# Altium project LED fix910 RD 2000278 (4F00224A_7P00494A).PrjPcb
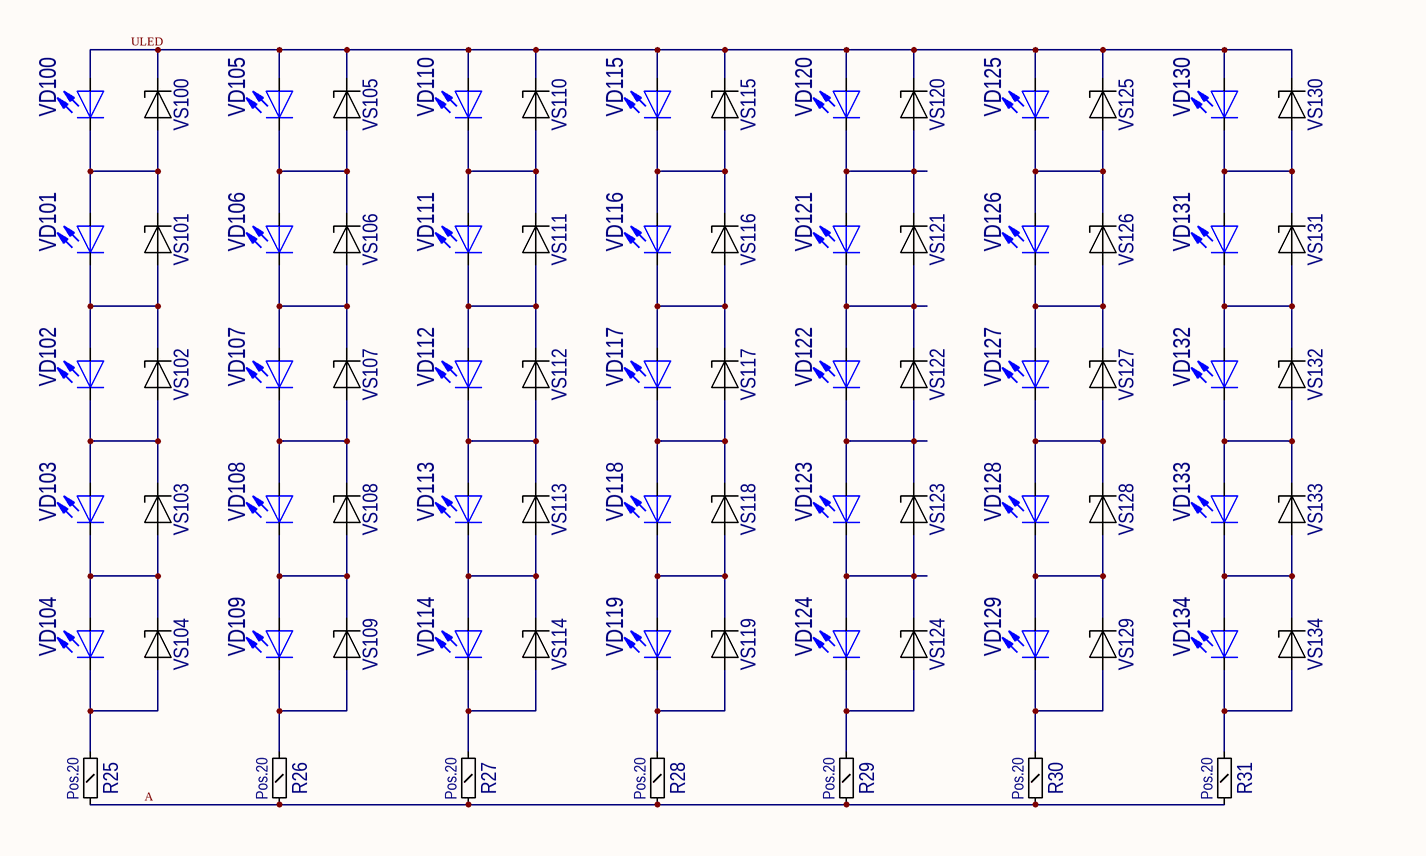
[diagram p0: LED fix910 RD 2000278 (4F00224A_7P00494A)_2.SchDoc, left]
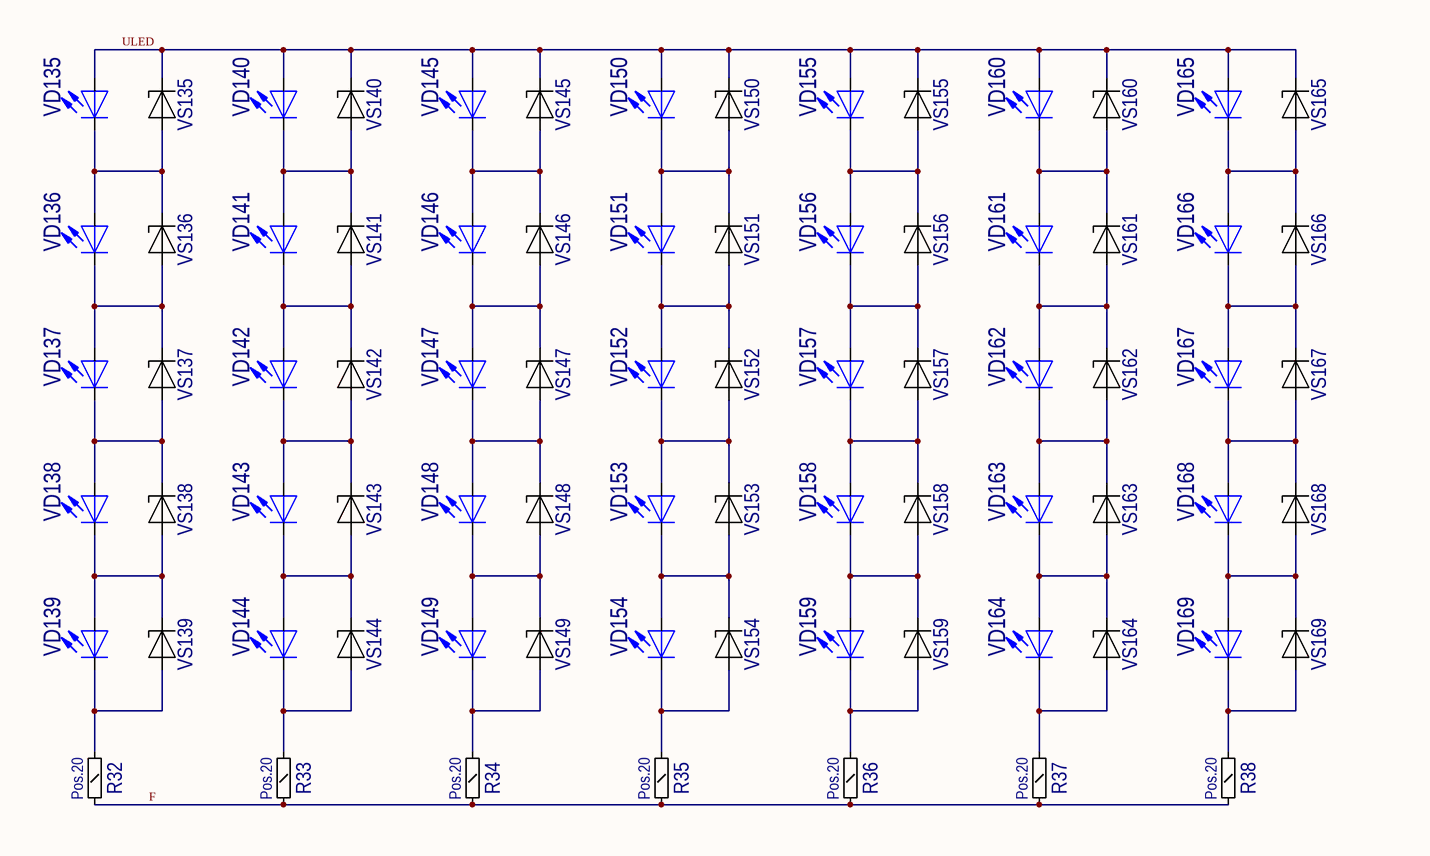
[diagram p1: LED fix910 RD 2000278 (4F00224A_7P00494A)_2.SchDoc, middle]
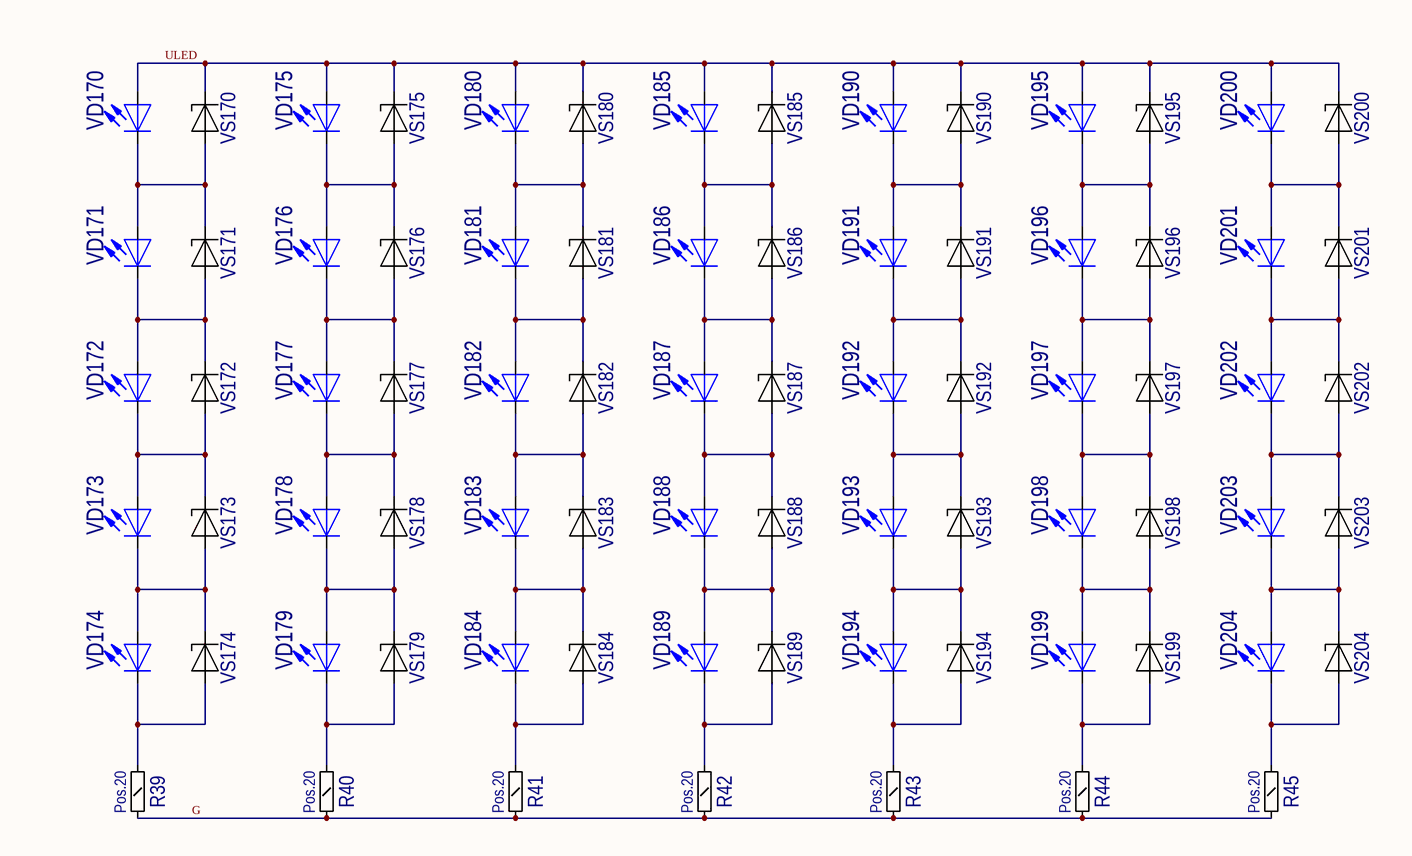
[diagram p2: LED fix910 RD 2000278 (4F00224A_7P00494A)_2.SchDoc, right]
2 sheets, 454 parts. Net scope: global (net labels, ports and power ports of the same name join across sheets).
Board file: LED fix910 RD 2000278 (4F00224A_7P00494A).PcbDoc
Sheets:
  LED fix910 RD 2000278 (4F00224A_7P00494A)_2.SchDoc
  LED fix910 RD 2000278 (4F00224A_7P00494A)_1.SchDoc

## Sheet LED fix910 RD 2000278 (4F00224A_7P00494A)_2.SchDoc
size 849 x 241 mm

### Parts
R25  value Pos.20  [RC1206S]  (hidden comment: R1206S)
R26  value Pos.20  [RC1206S]  (hidden comment: R1206S)
R27  value Pos.20  [RC1206S]  (hidden comment: R1206S)
R28  value Pos.20  [RC1206S]  (hidden comment: R1206S)
R29  value Pos.20  [RC1206S]  (hidden comment: R1206S)
R30  value Pos.20  [RC1206S]  (hidden comment: R1206S)
R31  value Pos.20  [RC1206S]  (hidden comment: R1206S)
R32  value Pos.20  [RC1206S]  (hidden comment: R1206S)
R33  value Pos.20  [RC1206S]  (hidden comment: R1206S)
R34  value Pos.20  [RC1206S]  (hidden comment: R1206S)
R35  value Pos.20  [RC1206S]  (hidden comment: R1206S)
R36  value Pos.20  [RC1206S]  (hidden comment: R1206S)
R37  value Pos.20  [RC1206S]  (hidden comment: R1206S)
R38  value Pos.20  [RC1206S]  (hidden comment: R1206S)
R39  value Pos.20  [RC1206S]  (hidden comment: R1206S)
R40  value Pos.20  [RC1206S]  (hidden comment: R1206S)
R41  value Pos.20  [RC1206S]  (hidden comment: R1206S)
R42  value Pos.20  [RC1206S]  (hidden comment: R1206S)
R43  value Pos.20  [RC1206S]  (hidden comment: R1206S)
R44  value Pos.20  [RC1206S]  (hidden comment: R1206S)
R45  value Pos.20  [RC1206S]  (hidden comment: R1206S)
VD100  LED, LS E65F-BBDA-1-Z, Red, OSRAM Opto Semiconductors Inc.  [E65F]  (value not drawn)
VD101  LED, LS E65F-BBDA-1-Z, Red, OSRAM Opto Semiconductors Inc.  [E65F]  (value not drawn)
VD102  LED, LS E65F-BBDA-1-Z, Red, OSRAM Opto Semiconductors Inc.  [E65F]  (value not drawn)
VD103  LED, LS E65F-BBDA-1-Z, Red, OSRAM Opto Semiconductors Inc.  [E65F]  (value not drawn)
VD104  LED, LS E65F-BBDA-1-Z, Red, OSRAM Opto Semiconductors Inc.  [E65F]  (value not drawn)
VD105  LED, LS E65F-BBDA-1-Z, Red, OSRAM Opto Semiconductors Inc.  [E65F]  (value not drawn)
VD106  LED, LS E65F-BBDA-1-Z, Red, OSRAM Opto Semiconductors Inc.  [E65F]  (value not drawn)
VD107  LED, LS E65F-BBDA-1-Z, Red, OSRAM Opto Semiconductors Inc.  [E65F]  (value not drawn)
VD108  LED, LS E65F-BBDA-1-Z, Red, OSRAM Opto Semiconductors Inc.  [E65F]  (value not drawn)
VD109  LED, LS E65F-BBDA-1-Z, Red, OSRAM Opto Semiconductors Inc.  [E65F]  (value not drawn)
VD110  LED, LS E65F-BBDA-1-Z, Red, OSRAM Opto Semiconductors Inc.  [E65F]  (value not drawn)
VD111  LED, LS E65F-BBDA-1-Z, Red, OSRAM Opto Semiconductors Inc.  [E65F]  (value not drawn)
VD112  LED, LS E65F-BBDA-1-Z, Red, OSRAM Opto Semiconductors Inc.  [E65F]  (value not drawn)
VD113  LED, LS E65F-BBDA-1-Z, Red, OSRAM Opto Semiconductors Inc.  [E65F]  (value not drawn)
VD114  LED, LS E65F-BBDA-1-Z, Red, OSRAM Opto Semiconductors Inc.  [E65F]  (value not drawn)
VD115  LED, LS E65F-BBDA-1-Z, Red, OSRAM Opto Semiconductors Inc.  [E65F]  (value not drawn)
VD116  LED, LS E65F-BBDA-1-Z, Red, OSRAM Opto Semiconductors Inc.  [E65F]  (value not drawn)
VD117  LED, LS E65F-BBDA-1-Z, Red, OSRAM Opto Semiconductors Inc.  [E65F]  (value not drawn)
VD118  LED, LS E65F-BBDA-1-Z, Red, OSRAM Opto Semiconductors Inc.  [E65F]  (value not drawn)
VD119  LED, LS E65F-BBDA-1-Z, Red, OSRAM Opto Semiconductors Inc.  [E65F]  (value not drawn)
VD120  LED, LS E65F-BBDA-1-Z, Red, OSRAM Opto Semiconductors Inc.  [E65F]  (value not drawn)
VD121  LED, LS E65F-BBDA-1-Z, Red, OSRAM Opto Semiconductors Inc.  [E65F]  (value not drawn)
VD122  LED, LS E65F-BBDA-1-Z, Red, OSRAM Opto Semiconductors Inc.  [E65F]  (value not drawn)
VD123  LED, LS E65F-BBDA-1-Z, Red, OSRAM Opto Semiconductors Inc.  [E65F]  (value not drawn)
VD124  LED, LS E65F-BBDA-1-Z, Red, OSRAM Opto Semiconductors Inc.  [E65F]  (value not drawn)
VD125  LED, LS E65F-BBDA-1-Z, Red, OSRAM Opto Semiconductors Inc.  [E65F]  (value not drawn)
VD126  LED, LS E65F-BBDA-1-Z, Red, OSRAM Opto Semiconductors Inc.  [E65F]  (value not drawn)
VD127  LED, LS E65F-BBDA-1-Z, Red, OSRAM Opto Semiconductors Inc.  [E65F]  (value not drawn)
VD128  LED, LS E65F-BBDA-1-Z, Red, OSRAM Opto Semiconductors Inc.  [E65F]  (value not drawn)
VD129  LED, LS E65F-BBDA-1-Z, Red, OSRAM Opto Semiconductors Inc.  [E65F]  (value not drawn)
VD130  LED, LS E65F-BBDA-1-Z, Red, OSRAM Opto Semiconductors Inc.  [E65F]  (value not drawn)
VD131  LED, LS E65F-BBDA-1-Z, Red, OSRAM Opto Semiconductors Inc.  [E65F]  (value not drawn)
VD132  LED, LS E65F-BBDA-1-Z, Red, OSRAM Opto Semiconductors Inc.  [E65F]  (value not drawn)
VD133  LED, LS E65F-BBDA-1-Z, Red, OSRAM Opto Semiconductors Inc.  [E65F]  (value not drawn)
VD134  LED, LS E65F-BBDA-1-Z, Red, OSRAM Opto Semiconductors Inc.  [E65F]  (value not drawn)
VD135  LED, LS E65F-BBDA-1-Z, Red, OSRAM Opto Semiconductors Inc.  [E65F]  (value not drawn)
VD136  LED, LS E65F-BBDA-1-Z, Red, OSRAM Opto Semiconductors Inc.  [E65F]  (value not drawn)
VD137  LED, LS E65F-BBDA-1-Z, Red, OSRAM Opto Semiconductors Inc.  [E65F]  (value not drawn)
VD138  LED, LS E65F-BBDA-1-Z, Red, OSRAM Opto Semiconductors Inc.  [E65F]  (value not drawn)
VD139  LED, LS E65F-BBDA-1-Z, Red, OSRAM Opto Semiconductors Inc.  [E65F]  (value not drawn)
VD140  LED, LS E65F-BBDA-1-Z, Red, OSRAM Opto Semiconductors Inc.  [E65F]  (value not drawn)
VD141  LED, LS E65F-BBDA-1-Z, Red, OSRAM Opto Semiconductors Inc.  [E65F]  (value not drawn)
VD142  LED, LS E65F-BBDA-1-Z, Red, OSRAM Opto Semiconductors Inc.  [E65F]  (value not drawn)
VD143  LED, LS E65F-BBDA-1-Z, Red, OSRAM Opto Semiconductors Inc.  [E65F]  (value not drawn)
VD144  LED, LS E65F-BBDA-1-Z, Red, OSRAM Opto Semiconductors Inc.  [E65F]  (value not drawn)
VD145  LED, LS E65F-BBDA-1-Z, Red, OSRAM Opto Semiconductors Inc.  [E65F]  (value not drawn)
VD146  LED, LS E65F-BBDA-1-Z, Red, OSRAM Opto Semiconductors Inc.  [E65F]  (value not drawn)
VD147  LED, LS E65F-BBDA-1-Z, Red, OSRAM Opto Semiconductors Inc.  [E65F]  (value not drawn)
VD148  LED, LS E65F-BBDA-1-Z, Red, OSRAM Opto Semiconductors Inc.  [E65F]  (value not drawn)
VD149  LED, LS E65F-BBDA-1-Z, Red, OSRAM Opto Semiconductors Inc.  [E65F]  (value not drawn)
VD150  LED, LS E65F-BBDA-1-Z, Red, OSRAM Opto Semiconductors Inc.  [E65F]  (value not drawn)
VD151  LED, LS E65F-BBDA-1-Z, Red, OSRAM Opto Semiconductors Inc.  [E65F]  (value not drawn)
VD152  LED, LS E65F-BBDA-1-Z, Red, OSRAM Opto Semiconductors Inc.  [E65F]  (value not drawn)
VD153  LED, LS E65F-BBDA-1-Z, Red, OSRAM Opto Semiconductors Inc.  [E65F]  (value not drawn)
VD154  LED, LS E65F-BBDA-1-Z, Red, OSRAM Opto Semiconductors Inc.  [E65F]  (value not drawn)
VD155  LED, LS E65F-BBDA-1-Z, Red, OSRAM Opto Semiconductors Inc.  [E65F]  (value not drawn)
VD156  LED, LS E65F-BBDA-1-Z, Red, OSRAM Opto Semiconductors Inc.  [E65F]  (value not drawn)
VD157  LED, LS E65F-BBDA-1-Z, Red, OSRAM Opto Semiconductors Inc.  [E65F]  (value not drawn)
VD158  LED, LS E65F-BBDA-1-Z, Red, OSRAM Opto Semiconductors Inc.  [E65F]  (value not drawn)
VD159  LED, LS E65F-BBDA-1-Z, Red, OSRAM Opto Semiconductors Inc.  [E65F]  (value not drawn)
VD160  LED, LS E65F-BBDA-1-Z, Red, OSRAM Opto Semiconductors Inc.  [E65F]  (value not drawn)
VD161  LED, LS E65F-BBDA-1-Z, Red, OSRAM Opto Semiconductors Inc.  [E65F]  (value not drawn)
VD162  LED, LS E65F-BBDA-1-Z, Red, OSRAM Opto Semiconductors Inc.  [E65F]  (value not drawn)
VD163  LED, LS E65F-BBDA-1-Z, Red, OSRAM Opto Semiconductors Inc.  [E65F]  (value not drawn)
VD164  LED, LS E65F-BBDA-1-Z, Red, OSRAM Opto Semiconductors Inc.  [E65F]  (value not drawn)
VD165  LED, LS E65F-BBDA-1-Z, Red, OSRAM Opto Semiconductors Inc.  [E65F]  (value not drawn)
VD166  LED, LS E65F-BBDA-1-Z, Red, OSRAM Opto Semiconductors Inc.  [E65F]  (value not drawn)
VD167  LED, LS E65F-BBDA-1-Z, Red, OSRAM Opto Semiconductors Inc.  [E65F]  (value not drawn)
VD168  LED, LS E65F-BBDA-1-Z, Red, OSRAM Opto Semiconductors Inc.  [E65F]  (value not drawn)
VD169  LED, LS E65F-BBDA-1-Z, Red, OSRAM Opto Semiconductors Inc.  [E65F]  (value not drawn)
VD170  LED, LS E65F-BBDA-1-Z, Red, OSRAM Opto Semiconductors Inc.  [E65F]  (value not drawn)
VD171  LED, LS E65F-BBDA-1-Z, Red, OSRAM Opto Semiconductors Inc.  [E65F]  (value not drawn)
VD172  LED, LS E65F-BBDA-1-Z, Red, OSRAM Opto Semiconductors Inc.  [E65F]  (value not drawn)
VD173  LED, LS E65F-BBDA-1-Z, Red, OSRAM Opto Semiconductors Inc.  [E65F]  (value not drawn)
VD174  LED, LS E65F-BBDA-1-Z, Red, OSRAM Opto Semiconductors Inc.  [E65F]  (value not drawn)
VD175  LED, LS E65F-BBDA-1-Z, Red, OSRAM Opto Semiconductors Inc.  [E65F]  (value not drawn)
VD176  LED, LS E65F-BBDA-1-Z, Red, OSRAM Opto Semiconductors Inc.  [E65F]  (value not drawn)
VD177  LED, LS E65F-BBDA-1-Z, Red, OSRAM Opto Semiconductors Inc.  [E65F]  (value not drawn)
VD178  LED, LS E65F-BBDA-1-Z, Red, OSRAM Opto Semiconductors Inc.  [E65F]  (value not drawn)
VD179  LED, LS E65F-BBDA-1-Z, Red, OSRAM Opto Semiconductors Inc.  [E65F]  (value not drawn)
VD180  LED, LS E65F-BBDA-1-Z, Red, OSRAM Opto Semiconductors Inc.  [E65F]  (value not drawn)
VD181  LED, LS E65F-BBDA-1-Z, Red, OSRAM Opto Semiconductors Inc.  [E65F]  (value not drawn)
VD182  LED, LS E65F-BBDA-1-Z, Red, OSRAM Opto Semiconductors Inc.  [E65F]  (value not drawn)
VD183  LED, LS E65F-BBDA-1-Z, Red, OSRAM Opto Semiconductors Inc.  [E65F]  (value not drawn)
VD184  LED, LS E65F-BBDA-1-Z, Red, OSRAM Opto Semiconductors Inc.  [E65F]  (value not drawn)
VD185  LED, LS E65F-BBDA-1-Z, Red, OSRAM Opto Semiconductors Inc.  [E65F]  (value not drawn)
VD186  LED, LS E65F-BBDA-1-Z, Red, OSRAM Opto Semiconductors Inc.  [E65F]  (value not drawn)
VD187  LED, LS E65F-BBDA-1-Z, Red, OSRAM Opto Semiconductors Inc.  [E65F]  (value not drawn)
VD188  LED, LS E65F-BBDA-1-Z, Red, OSRAM Opto Semiconductors Inc.  [E65F]  (value not drawn)
VD189  LED, LS E65F-BBDA-1-Z, Red, OSRAM Opto Semiconductors Inc.  [E65F]  (value not drawn)
VD190  LED, LS E65F-BBDA-1-Z, Red, OSRAM Opto Semiconductors Inc.  [E65F]  (value not drawn)
VD191  LED, LS E65F-BBDA-1-Z, Red, OSRAM Opto Semiconductors Inc.  [E65F]  (value not drawn)
VD192  LED, LS E65F-BBDA-1-Z, Red, OSRAM Opto Semiconductors Inc.  [E65F]  (value not drawn)
VD193  LED, LS E65F-BBDA-1-Z, Red, OSRAM Opto Semiconductors Inc.  [E65F]  (value not drawn)
VD194  LED, LS E65F-BBDA-1-Z, Red, OSRAM Opto Semiconductors Inc.  [E65F]  (value not drawn)
VD195  LED, LS E65F-BBDA-1-Z, Red, OSRAM Opto Semiconductors Inc.  [E65F]  (value not drawn)
VD196  LED, LS E65F-BBDA-1-Z, Red, OSRAM Opto Semiconductors Inc.  [E65F]  (value not drawn)
VD197  LED, LS E65F-BBDA-1-Z, Red, OSRAM Opto Semiconductors Inc.  [E65F]  (value not drawn)
VD198  LED, LS E65F-BBDA-1-Z, Red, OSRAM Opto Semiconductors Inc.  [E65F]  (value not drawn)
VD199  LED, LS E65F-BBDA-1-Z, Red, OSRAM Opto Semiconductors Inc.  [E65F]  (value not drawn)
VD200  LED, LS E65F-BBDA-1-Z, Red, OSRAM Opto Semiconductors Inc.  [E65F]  (value not drawn)
VD201  LED, LS E65F-BBDA-1-Z, Red, OSRAM Opto Semiconductors Inc.  [E65F]  (value not drawn)
VD202  LED, LS E65F-BBDA-1-Z, Red, OSRAM Opto Semiconductors Inc.  [E65F]  (value not drawn)
VD203  LED, LS E65F-BBDA-1-Z, Red, OSRAM Opto Semiconductors Inc.  [E65F]  (value not drawn)
VD204  LED, LS E65F-BBDA-1-Z, Red, OSRAM Opto Semiconductors Inc.  [E65F]  (value not drawn)
VS100  BZX84  [SOT23]  (value not drawn)
VS101  BZX84  [SOT23]  (value not drawn)
VS102  BZX84  [SOT23]  (value not drawn)
VS103  BZX84  [SOT23]  (value not drawn)
VS104  BZX84  [SOT23]  (value not drawn)
VS105  BZX84  [SOT23]  (value not drawn)
VS106  BZX84  [SOT23]  (value not drawn)
VS107  BZX84  [SOT23]  (value not drawn)
VS108  BZX84  [SOT23]  (value not drawn)
VS109  BZX84  [SOT23]  (value not drawn)
VS110  BZX84  [SOT23]  (value not drawn)
VS111  BZX84  [SOT23]  (value not drawn)
VS112  BZX84  [SOT23]  (value not drawn)
VS113  BZX84  [SOT23]  (value not drawn)
VS114  BZX84  [SOT23]  (value not drawn)
VS115  BZX84  [SOT23]  (value not drawn)
VS116  BZX84  [SOT23]  (value not drawn)
VS117  BZX84  [SOT23]  (value not drawn)
VS118  BZX84  [SOT23]  (value not drawn)
VS119  BZX84  [SOT23]  (value not drawn)
VS120  BZX84  [SOT23]  (value not drawn)
VS121  BZX84  [SOT23]  (value not drawn)
VS122  BZX84  [SOT23]  (value not drawn)
VS123  BZX84  [SOT23]  (value not drawn)
VS124  BZX84  [SOT23]  (value not drawn)
VS125  BZX84  [SOT23]  (value not drawn)
VS126  BZX84  [SOT23]  (value not drawn)
VS127  BZX84  [SOT23]  (value not drawn)
VS128  BZX84  [SOT23]  (value not drawn)
VS129  BZX84  [SOT23]  (value not drawn)
VS130  BZX84  [SOT23]  (value not drawn)
VS131  BZX84  [SOT23]  (value not drawn)
VS132  BZX84  [SOT23]  (value not drawn)
VS133  BZX84  [SOT23]  (value not drawn)
VS134  BZX84  [SOT23]  (value not drawn)
VS135  BZX84  [SOT23]  (value not drawn)
VS136  BZX84  [SOT23]  (value not drawn)
VS137  BZX84  [SOT23]  (value not drawn)
VS138  BZX84  [SOT23]  (value not drawn)
VS139  BZX84  [SOT23]  (value not drawn)
VS140  BZX84  [SOT23]  (value not drawn)
VS141  BZX84  [SOT23]  (value not drawn)
VS142  BZX84  [SOT23]  (value not drawn)
VS143  BZX84  [SOT23]  (value not drawn)
VS144  BZX84  [SOT23]  (value not drawn)
VS145  BZX84  [SOT23]  (value not drawn)
VS146  BZX84  [SOT23]  (value not drawn)
VS147  BZX84  [SOT23]  (value not drawn)
VS148  BZX84  [SOT23]  (value not drawn)
VS149  BZX84  [SOT23]  (value not drawn)
VS150  BZX84  [SOT23]  (value not drawn)
VS151  BZX84  [SOT23]  (value not drawn)
VS152  BZX84  [SOT23]  (value not drawn)
VS153  BZX84  [SOT23]  (value not drawn)
VS154  BZX84  [SOT23]  (value not drawn)
VS155  BZX84  [SOT23]  (value not drawn)
VS156  BZX84  [SOT23]  (value not drawn)
VS157  BZX84  [SOT23]  (value not drawn)
VS158  BZX84  [SOT23]  (value not drawn)
VS159  BZX84  [SOT23]  (value not drawn)
VS160  BZX84  [SOT23]  (value not drawn)
VS161  BZX84  [SOT23]  (value not drawn)
VS162  BZX84  [SOT23]  (value not drawn)
VS163  BZX84  [SOT23]  (value not drawn)
VS164  BZX84  [SOT23]  (value not drawn)
VS165  BZX84  [SOT23]  (value not drawn)
VS166  BZX84  [SOT23]  (value not drawn)
VS167  BZX84  [SOT23]  (value not drawn)
VS168  BZX84  [SOT23]  (value not drawn)
VS169  BZX84  [SOT23]  (value not drawn)
VS170  BZX84  [SOT23]  (value not drawn)
VS171  BZX84  [SOT23]  (value not drawn)
VS172  BZX84  [SOT23]  (value not drawn)
VS173  BZX84  [SOT23]  (value not drawn)
VS174  BZX84  [SOT23]  (value not drawn)
VS175  BZX84  [SOT23]  (value not drawn)
VS176  BZX84  [SOT23]  (value not drawn)
VS177  BZX84  [SOT23]  (value not drawn)
VS178  BZX84  [SOT23]  (value not drawn)
VS179  BZX84  [SOT23]  (value not drawn)
VS180  BZX84  [SOT23]  (value not drawn)
VS181  BZX84  [SOT23]  (value not drawn)
VS182  BZX84  [SOT23]  (value not drawn)
VS183  BZX84  [SOT23]  (value not drawn)
VS184  BZX84  [SOT23]  (value not drawn)
VS185  BZX84  [SOT23]  (value not drawn)
VS186  BZX84  [SOT23]  (value not drawn)
VS187  BZX84  [SOT23]  (value not drawn)
VS188  BZX84  [SOT23]  (value not drawn)
VS189  BZX84  [SOT23]  (value not drawn)
VS190  BZX84  [SOT23]  (value not drawn)
VS191  BZX84  [SOT23]  (value not drawn)
VS192  BZX84  [SOT23]  (value not drawn)
VS193  BZX84  [SOT23]  (value not drawn)
VS194  BZX84  [SOT23]  (value not drawn)
VS195  BZX84  [SOT23]  (value not drawn)
VS196  BZX84  [SOT23]  (value not drawn)
VS197  BZX84  [SOT23]  (value not drawn)
VS198  BZX84  [SOT23]  (value not drawn)
VS199  BZX84  [SOT23]  (value not drawn)
VS200  BZX84  [SOT23]  (value not drawn)
VS201  BZX84  [SOT23]  (value not drawn)
VS202  BZX84  [SOT23]  (value not drawn)
VS203  BZX84  [SOT23]  (value not drawn)
VS204  BZX84  [SOT23]  (value not drawn)

### Nets
A: R25.2 R26.2 R27.2 R28.2 R29.2 R30.2 R31.2
F: R32.2 R33.2 R34.2 R35.2 R36.2 R37.2 R38.2
G: R39.2 R40.2 R41.2 R42.2 R43.2 R44.2 R45.2
ULED: VD100.2(A) VD105.2(A) VD110.2(A) VD115.2(A) VD120.2(A) VD125.2(A) VD130.2(A) VD135.2(A) VD140.2(A) VD145.2(A) VD150.2(A) VD155.2(A) VD160.2(A) VD165.2(A) VD170.2(A) VD175.2(A) VD180.2(A) VD185.2(A) VD190.2(A) VD195.2(A) VD200.2(A) VS100.3 VS105.3 VS110.3 VS115.3 VS120.3 VS125.3 VS130.3 VS135.3 VS140.3 VS145.3 VS150.3 VS155.3 VS160.3 VS165.3 VS170.3 VS175.3 VS180.3 VS185.3 VS190.3 VS195.3 VS200.3
NetR25_1: R25.1 VD104.1(K) VS104.1
NetR26_1: R26.1 VD109.1(K) VS109.1
NetR27_1: R27.1 VD114.1(K) VS114.1
NetR28_1: R28.1 VD119.1(K) VS119.1
NetR29_1: R29.1 VD124.1(K) VS124.1
NetR30_1: R30.1 VD129.1(K) VS129.1
NetR31_1: R31.1 VD134.1(K) VS134.1
NetR32_1: R32.1 VD139.1(K) VS139.1
NetR33_1: R33.1 VD144.1(K) VS144.1
NetR34_1: R34.1 VD149.1(K) VS149.1
NetR35_1: R35.1 VD154.1(K) VS154.1
NetR36_1: R36.1 VD159.1(K) VS159.1
NetR37_1: R37.1 VD164.1(K) VS164.1
NetR38_1: R38.1 VD169.1(K) VS169.1
NetR39_1: R39.1 VD174.1(K) VS174.1
NetR40_1: R40.1 VD179.1(K) VS179.1
NetR41_1: R41.1 VD184.1(K) VS184.1
NetR42_1: R42.1 VD189.1(K) VS189.1
NetR43_1: R43.1 VD194.1(K) VS194.1
NetR44_1: R44.1 VD199.1(K) VS199.1
NetR45_1: R45.1 VD204.1(K) VS204.1
NetVD100_1: VD100.1(K) VD101.2(A) VS100.1 VS101.3
NetVD101_1: VD101.1(K) VD102.2(A) VS101.1 VS102.3
NetVD102_1: VD102.1(K) VD103.2(A) VS102.1 VS103.3
NetVD103_1: VD103.1(K) VD104.2(A) VS103.1 VS104.3
NetVD105_1: VD105.1(K) VD106.2(A) VS105.1 VS106.3
NetVD106_1: VD106.1(K) VD107.2(A) VS106.1 VS107.3
NetVD107_1: VD107.1(K) VD108.2(A) VS107.1 VS108.3
NetVD108_1: VD108.1(K) VD109.2(A) VS108.1 VS109.3
NetVD110_1: VD110.1(K) VD111.2(A) VS110.1 VS111.3
NetVD111_1: VD111.1(K) VD112.2(A) VS111.1 VS112.3
NetVD112_1: VD112.1(K) VD113.2(A) VS112.1 VS113.3
NetVD113_1: VD113.1(K) VD114.2(A) VS113.1 VS114.3
NetVD115_1: VD115.1(K) VD116.2(A) VS115.1 VS116.3
NetVD116_1: VD116.1(K) VD117.2(A) VS116.1 VS117.3
NetVD117_1: VD117.1(K) VD118.2(A) VS117.1 VS118.3
NetVD118_1: VD118.1(K) VD119.2(A) VS118.1 VS119.3
NetVD120_1: VD120.1(K) VD121.2(A) VS120.1 VS121.3
NetVD121_1: VD121.1(K) VD122.2(A) VS121.1 VS122.3
NetVD122_1: VD122.1(K) VD123.2(A) VS122.1 VS123.3
NetVD123_1: VD123.1(K) VD124.2(A) VS123.1 VS124.3
NetVD125_1: VD125.1(K) VD126.2(A) VS125.1 VS126.3
NetVD126_1: VD126.1(K) VD127.2(A) VS126.1 VS127.3
NetVD127_1: VD127.1(K) VD128.2(A) VS127.1 VS128.3
NetVD128_1: VD128.1(K) VD129.2(A) VS128.1 VS129.3
NetVD130_1: VD130.1(K) VD131.2(A) VS130.1 VS131.3
NetVD131_1: VD131.1(K) VD132.2(A) VS131.1 VS132.3
NetVD132_1: VD132.1(K) VD133.2(A) VS132.1 VS133.3
NetVD133_1: VD133.1(K) VD134.2(A) VS133.1 VS134.3
NetVD135_1: VD135.1(K) VD136.2(A) VS135.1 VS136.3
NetVD136_1: VD136.1(K) VD137.2(A) VS136.1 VS137.3
NetVD137_1: VD137.1(K) VD138.2(A) VS137.1 VS138.3
NetVD138_1: VD138.1(K) VD139.2(A) VS138.1 VS139.3
NetVD140_1: VD140.1(K) VD141.2(A) VS140.1 VS141.3
NetVD141_1: VD141.1(K) VD142.2(A) VS141.1 VS142.3
NetVD142_1: VD142.1(K) VD143.2(A) VS142.1 VS143.3
NetVD143_1: VD143.1(K) VD144.2(A) VS143.1 VS144.3
NetVD145_1: VD145.1(K) VD146.2(A) VS145.1 VS146.3
NetVD146_1: VD146.1(K) VD147.2(A) VS146.1 VS147.3
NetVD147_1: VD147.1(K) VD148.2(A) VS147.1 VS148.3
NetVD148_1: VD148.1(K) VD149.2(A) VS148.1 VS149.3
NetVD150_1: VD150.1(K) VD151.2(A) VS150.1 VS151.3
NetVD151_1: VD151.1(K) VD152.2(A) VS151.1 VS152.3
NetVD152_1: VD152.1(K) VD153.2(A) VS152.1 VS153.3
NetVD153_1: VD153.1(K) VD154.2(A) VS153.1 VS154.3
NetVD155_1: VD155.1(K) VD156.2(A) VS155.1 VS156.3
NetVD156_1: VD156.1(K) VD157.2(A) VS156.1 VS157.3
NetVD157_1: VD157.1(K) VD158.2(A) VS157.1 VS158.3
NetVD158_1: VD158.1(K) VD159.2(A) VS158.1 VS159.3
NetVD160_1: VD160.1(K) VD161.2(A) VS160.1 VS161.3
NetVD161_1: VD161.1(K) VD162.2(A) VS161.1 VS162.3
NetVD162_1: VD162.1(K) VD163.2(A) VS162.1 VS163.3
NetVD163_1: VD163.1(K) VD164.2(A) VS163.1 VS164.3
NetVD165_1: VD165.1(K) VD166.2(A) VS165.1 VS166.3
NetVD166_1: VD166.1(K) VD167.2(A) VS166.1 VS167.3
NetVD167_1: VD167.1(K) VD168.2(A) VS167.1 VS168.3
NetVD168_1: VD168.1(K) VD169.2(A) VS168.1 VS169.3
NetVD170_1: VD170.1(K) VD171.2(A) VS170.1 VS171.3
NetVD171_1: VD171.1(K) VD172.2(A) VS171.1 VS172.3
NetVD172_1: VD172.1(K) VD173.2(A) VS172.1 VS173.3
NetVD173_1: VD173.1(K) VD174.2(A) VS173.1 VS174.3
NetVD175_1: VD175.1(K) VD176.2(A) VS175.1 VS176.3
NetVD176_1: VD176.1(K) VD177.2(A) VS176.1 VS177.3
NetVD177_1: VD177.1(K) VD178.2(A) VS177.1 VS178.3
NetVD178_1: VD178.1(K) VD179.2(A) VS178.1 VS179.3
NetVD180_1: VD180.1(K) VD181.2(A) VS180.1 VS181.3
NetVD181_1: VD181.1(K) VD182.2(A) VS181.1 VS182.3
NetVD182_1: VD182.1(K) VD183.2(A) VS182.1 VS183.3
NetVD183_1: VD183.1(K) VD184.2(A) VS183.1 VS184.3
NetVD185_1: VD185.1(K) VD186.2(A) VS185.1 VS186.3
NetVD186_1: VD186.1(K) VD187.2(A) VS186.1 VS187.3
NetVD187_1: VD187.1(K) VD188.2(A) VS187.1 VS188.3
NetVD188_1: VD188.1(K) VD189.2(A) VS188.1 VS189.3
NetVD190_1: VD190.1(K) VD191.2(A) VS190.1 VS191.3
NetVD191_1: VD191.1(K) VD192.2(A) VS191.1 VS192.3
NetVD192_1: VD192.1(K) VD193.2(A) VS192.1 VS193.3
NetVD193_1: VD193.1(K) VD194.2(A) VS193.1 VS194.3
NetVD195_1: VD195.1(K) VD196.2(A) VS195.1 VS196.3
NetVD196_1: VD196.1(K) VD197.2(A) VS196.1 VS197.3
NetVD197_1: VD197.1(K) VD198.2(A) VS197.1 VS198.3
NetVD198_1: VD198.1(K) VD199.2(A) VS198.1 VS199.3
NetVD200_1: VD200.1(K) VD201.2(A) VS200.1 VS201.3
NetVD201_1: VD201.1(K) VD202.2(A) VS201.1 VS202.3
NetVD202_1: VD202.1(K) VD203.2(A) VS202.1 VS203.3
NetVD203_1: VD203.1(K) VD204.2(A) VS203.1 VS204.3

Not connected (* = marked no-connect by the designer): VS100 2; VS101 2; VS102 2; VS103 2; VS104 2; VS105 2; VS106 2; VS107 2; VS108 2; VS109 2; VS110 2; VS111 2; VS112 2; VS113 2; VS114 2; VS115 2; VS116 2; VS117 2; VS118 2; VS119 2; VS120 2; VS121 2; VS122 2; VS123 2; VS124 2; VS125 2; VS126 2; VS127 2; VS128 2; VS129 2; VS130 2; VS131 2; VS132 2; VS133 2; VS134 2; VS135 2; VS136 2; VS137 2; VS138 2; VS139 2; VS140 2; VS141 2; VS142 2; VS143 2; VS144 2; VS145 2; VS146 2; VS147 2; VS148 2; VS149 2; VS150 2; VS151 2; VS152 2; VS153 2; VS154 2; VS155 2; VS156 2; VS157 2; VS158 2; VS159 2; VS160 2; VS161 2; VS162 2; VS163 2; VS164 2; VS165 2; VS166 2; VS167 2; VS168 2; VS169 2; VS170 2; VS171 2; VS172 2; VS173 2; VS174 2; VS175 2; VS176 2; VS177 2; VS178 2; VS179 2; VS180 2; VS181 2; VS182 2; VS183 2; VS184 2; VS185 2; VS186 2; VS187 2; VS188 2; VS189 2; VS190 2; VS191 2; VS192 2; VS193 2; VS194 2; VS195 2; VS196 2; VS197 2; VS198 2; VS199 2; VS200 2; VS201 2; VS202 2; VS203 2; VS204 2

### Library data of the parts
VD100-VD204 = 4176: idComponent: 4176; Jofre_PN: HL1032; Component_Group: Diodes; Tech_Specification: LED Chip, LS E65F-BBDA-1-Z, Red, 633nm, 3920mcd, 60 deg, 2,15V, 50 mA, -40°C...+85°C, PLCC-4, OSRAM Opto Semiconductors Inc.; Mounting_Type: SMD; Operating_Temperature: -40°C...+85°C; Notes: price Digi-Key @2.000; User: ke-sta@kd-sta; Value: LS E65F-BBDA-1-Z; Component_Type: LED; Package: PLCC-4; Marking_Code: -; Manufacturer: OSRAM Opto Semiconductors Inc.; Manufacturer_PN: LS E65F-BBDA-1-Z; ComponentLink1Description: Datasheet; ComponentLink1URL: https://media.digikey.com/pdf/Data%20Sheets/Osram%20PDFs/LS_E65F_Rev1.2.pdf; Price_EUR: 0,15835; Status: Unchecked; Date_of_Update: 12.11.2018 13:55:11; Date_of_Creation: 30.10.2018 19:15:38
VS100-VS204 = BZX84: OriginalName: DIODE; Value: *

## Sheet LED fix910 RD 2000278 (4F00224A_7P00494A)_1.SchDoc
size 900 x 281 mm
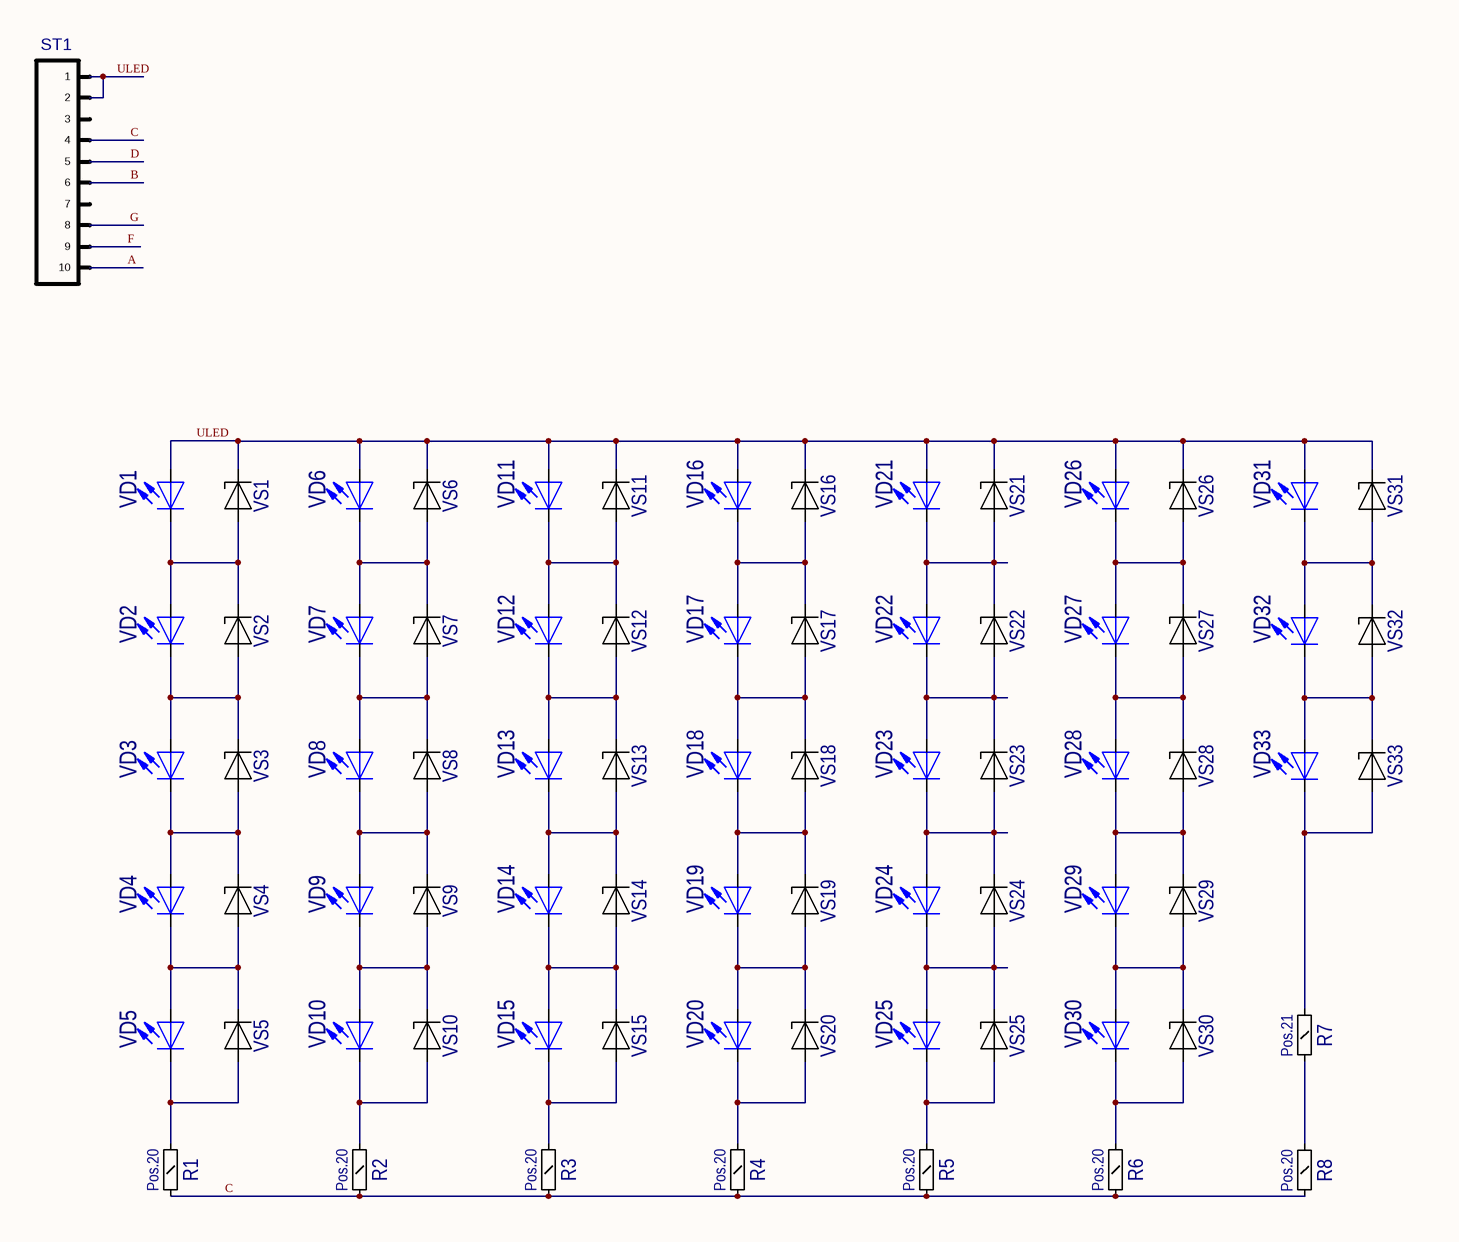
[diagram p3: LED fix910 RD 2000278 (4F00224A_7P00494A)_1.SchDoc, left]
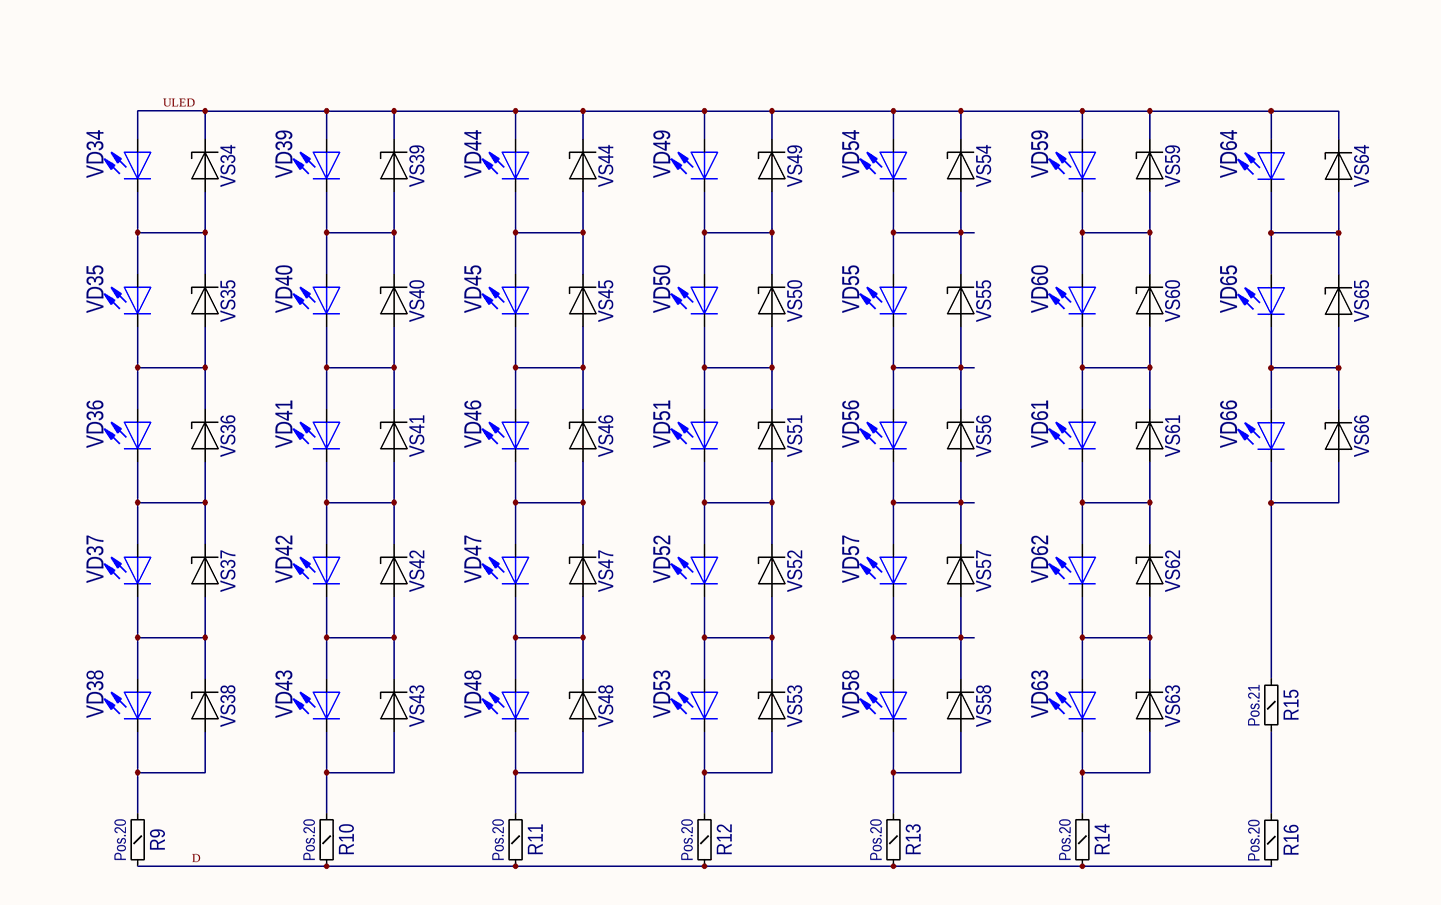
[diagram p4: LED fix910 RD 2000278 (4F00224A_7P00494A)_1.SchDoc, middle]
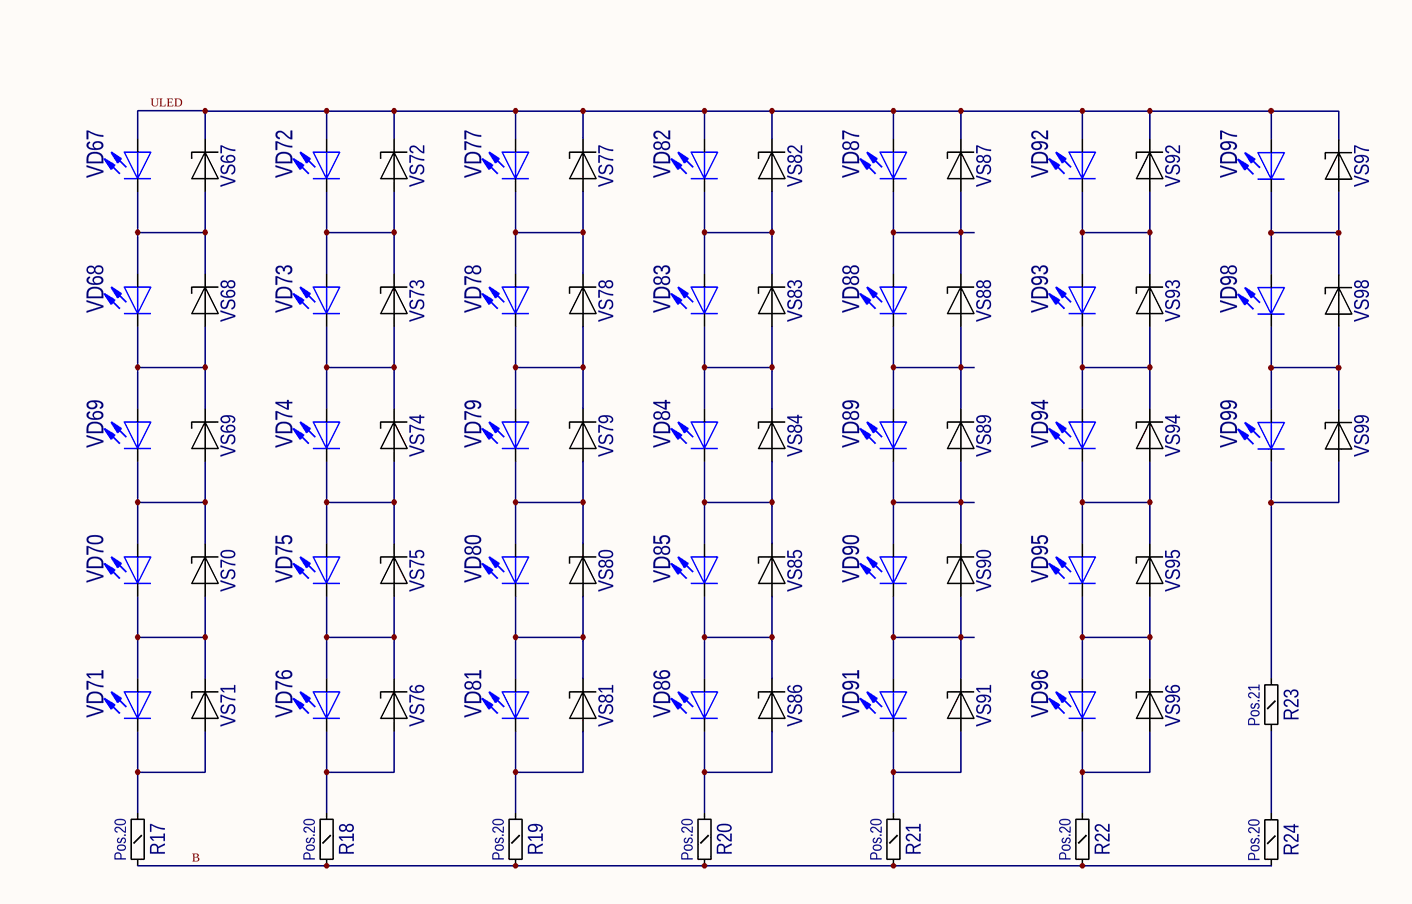
[diagram p5: LED fix910 RD 2000278 (4F00224A_7P00494A)_1.SchDoc, right]

### Parts
R1  value Pos.20  [RC1206S]  (hidden comment: R1206S)
R2  value Pos.20  [RC1206S]  (hidden comment: R1206S)
R3  value Pos.20  [RC1206S]  (hidden comment: R1206S)
R4  value Pos.20  [RC1206S]  (hidden comment: R1206S)
R5  value Pos.20  [RC1206S]  (hidden comment: R1206S)
R6  value Pos.20  [RC1206S]  (hidden comment: R1206S)
R7  value Pos.21  [RC1206S]  (hidden comment: R1206S)
R8  value Pos.20  [RC1206S]  (hidden comment: R1206S)
R9  value Pos.20  [RC1206S]  (hidden comment: R1206S)
R10  value Pos.20  [RC1206S]  (hidden comment: R1206S)
R11  value Pos.20  [RC1206S]  (hidden comment: R1206S)
R12  value Pos.20  [RC1206S]  (hidden comment: R1206S)
R13  value Pos.20  [RC1206S]  (hidden comment: R1206S)
R14  value Pos.20  [RC1206S]  (hidden comment: R1206S)
R15  value Pos.21  [RC1206S]  (hidden comment: R1206S)
R16  value Pos.20  [RC1206S]  (hidden comment: R1206S)
R17  value Pos.20  [RC1206S]  (hidden comment: R1206S)
R18  value Pos.20  [RC1206S]  (hidden comment: R1206S)
R19  value Pos.20  [RC1206S]  (hidden comment: R1206S)
R20  value Pos.20  [RC1206S]  (hidden comment: R1206S)
R21  value Pos.20  [RC1206S]  (hidden comment: R1206S)
R22  value Pos.20  [RC1206S]  (hidden comment: R1206S)
R23  value Pos.21  [RC1206S]  (hidden comment: R1206S)
R24  value Pos.20  [RC1206S]  (hidden comment: R1206S)
ST1  BAND10_M  [BAND10_M]  (value not drawn)
VD1  LED, LS E65F-BBDA-1-Z, Red, OSRAM Opto Semiconductors Inc.  [E65F]  (value not drawn)
VD2  LED, LS E65F-BBDA-1-Z, Red, OSRAM Opto Semiconductors Inc.  [E65F]  (value not drawn)
VD3  LED, LS E65F-BBDA-1-Z, Red, OSRAM Opto Semiconductors Inc.  [E65F]  (value not drawn)
VD4  LED, LS E65F-BBDA-1-Z, Red, OSRAM Opto Semiconductors Inc.  [E65F]  (value not drawn)
VD5  LED, LS E65F-BBDA-1-Z, Red, OSRAM Opto Semiconductors Inc.  [E65F]  (value not drawn)
VD6  LED, LS E65F-BBDA-1-Z, Red, OSRAM Opto Semiconductors Inc.  [E65F]  (value not drawn)
VD7  LED, LS E65F-BBDA-1-Z, Red, OSRAM Opto Semiconductors Inc.  [E65F]  (value not drawn)
VD8  LED, LS E65F-BBDA-1-Z, Red, OSRAM Opto Semiconductors Inc.  [E65F]  (value not drawn)
VD9  LED, LS E65F-BBDA-1-Z, Red, OSRAM Opto Semiconductors Inc.  [E65F]  (value not drawn)
VD10  LED, LS E65F-BBDA-1-Z, Red, OSRAM Opto Semiconductors Inc.  [E65F]  (value not drawn)
VD11  LED, LS E65F-BBDA-1-Z, Red, OSRAM Opto Semiconductors Inc.  [E65F]  (value not drawn)
VD12  LED, LS E65F-BBDA-1-Z, Red, OSRAM Opto Semiconductors Inc.  [E65F]  (value not drawn)
VD13  LED, LS E65F-BBDA-1-Z, Red, OSRAM Opto Semiconductors Inc.  [E65F]  (value not drawn)
VD14  LED, LS E65F-BBDA-1-Z, Red, OSRAM Opto Semiconductors Inc.  [E65F]  (value not drawn)
VD15  LED, LS E65F-BBDA-1-Z, Red, OSRAM Opto Semiconductors Inc.  [E65F]  (value not drawn)
VD16  LED, LS E65F-BBDA-1-Z, Red, OSRAM Opto Semiconductors Inc.  [E65F]  (value not drawn)
VD17  LED, LS E65F-BBDA-1-Z, Red, OSRAM Opto Semiconductors Inc.  [E65F]  (value not drawn)
VD18  LED, LS E65F-BBDA-1-Z, Red, OSRAM Opto Semiconductors Inc.  [E65F]  (value not drawn)
VD19  LED, LS E65F-BBDA-1-Z, Red, OSRAM Opto Semiconductors Inc.  [E65F]  (value not drawn)
VD20  LED, LS E65F-BBDA-1-Z, Red, OSRAM Opto Semiconductors Inc.  [E65F]  (value not drawn)
VD21  LED, LS E65F-BBDA-1-Z, Red, OSRAM Opto Semiconductors Inc.  [E65F]  (value not drawn)
VD22  LED, LS E65F-BBDA-1-Z, Red, OSRAM Opto Semiconductors Inc.  [E65F]  (value not drawn)
VD23  LED, LS E65F-BBDA-1-Z, Red, OSRAM Opto Semiconductors Inc.  [E65F]  (value not drawn)
VD24  LED, LS E65F-BBDA-1-Z, Red, OSRAM Opto Semiconductors Inc.  [E65F]  (value not drawn)
VD25  LED, LS E65F-BBDA-1-Z, Red, OSRAM Opto Semiconductors Inc.  [E65F]  (value not drawn)
VD26  LED, LS E65F-BBDA-1-Z, Red, OSRAM Opto Semiconductors Inc.  [E65F]  (value not drawn)
VD27  LED, LS E65F-BBDA-1-Z, Red, OSRAM Opto Semiconductors Inc.  [E65F]  (value not drawn)
VD28  LED, LS E65F-BBDA-1-Z, Red, OSRAM Opto Semiconductors Inc.  [E65F]  (value not drawn)
VD29  LED, LS E65F-BBDA-1-Z, Red, OSRAM Opto Semiconductors Inc.  [E65F]  (value not drawn)
VD30  LED, LS E65F-BBDA-1-Z, Red, OSRAM Opto Semiconductors Inc.  [E65F]  (value not drawn)
VD31  LED, LS E65F-BBDA-1-Z, Red, OSRAM Opto Semiconductors Inc.  [E65F]  (value not drawn)
VD32  LED, LS E65F-BBDA-1-Z, Red, OSRAM Opto Semiconductors Inc.  [E65F]  (value not drawn)
VD33  LED, LS E65F-BBDA-1-Z, Red, OSRAM Opto Semiconductors Inc.  [E65F]  (value not drawn)
VD34  LED, LS E65F-BBDA-1-Z, Red, OSRAM Opto Semiconductors Inc.  [E65F]  (value not drawn)
VD35  LED, LS E65F-BBDA-1-Z, Red, OSRAM Opto Semiconductors Inc.  [E65F]  (value not drawn)
VD36  LED, LS E65F-BBDA-1-Z, Red, OSRAM Opto Semiconductors Inc.  [E65F]  (value not drawn)
VD37  LED, LS E65F-BBDA-1-Z, Red, OSRAM Opto Semiconductors Inc.  [E65F]  (value not drawn)
VD38  LED, LS E65F-BBDA-1-Z, Red, OSRAM Opto Semiconductors Inc.  [E65F]  (value not drawn)
VD39  LED, LS E65F-BBDA-1-Z, Red, OSRAM Opto Semiconductors Inc.  [E65F]  (value not drawn)
VD40  LED, LS E65F-BBDA-1-Z, Red, OSRAM Opto Semiconductors Inc.  [E65F]  (value not drawn)
VD41  LED, LS E65F-BBDA-1-Z, Red, OSRAM Opto Semiconductors Inc.  [E65F]  (value not drawn)
VD42  LED, LS E65F-BBDA-1-Z, Red, OSRAM Opto Semiconductors Inc.  [E65F]  (value not drawn)
VD43  LED, LS E65F-BBDA-1-Z, Red, OSRAM Opto Semiconductors Inc.  [E65F]  (value not drawn)
VD44  LED, LS E65F-BBDA-1-Z, Red, OSRAM Opto Semiconductors Inc.  [E65F]  (value not drawn)
VD45  LED, LS E65F-BBDA-1-Z, Red, OSRAM Opto Semiconductors Inc.  [E65F]  (value not drawn)
VD46  LED, LS E65F-BBDA-1-Z, Red, OSRAM Opto Semiconductors Inc.  [E65F]  (value not drawn)
VD47  LED, LS E65F-BBDA-1-Z, Red, OSRAM Opto Semiconductors Inc.  [E65F]  (value not drawn)
VD48  LED, LS E65F-BBDA-1-Z, Red, OSRAM Opto Semiconductors Inc.  [E65F]  (value not drawn)
VD49  LED, LS E65F-BBDA-1-Z, Red, OSRAM Opto Semiconductors Inc.  [E65F]  (value not drawn)
VD50  LED, LS E65F-BBDA-1-Z, Red, OSRAM Opto Semiconductors Inc.  [E65F]  (value not drawn)
VD51  LED, LS E65F-BBDA-1-Z, Red, OSRAM Opto Semiconductors Inc.  [E65F]  (value not drawn)
VD52  LED, LS E65F-BBDA-1-Z, Red, OSRAM Opto Semiconductors Inc.  [E65F]  (value not drawn)
VD53  LED, LS E65F-BBDA-1-Z, Red, OSRAM Opto Semiconductors Inc.  [E65F]  (value not drawn)
VD54  LED, LS E65F-BBDA-1-Z, Red, OSRAM Opto Semiconductors Inc.  [E65F]  (value not drawn)
VD55  LED, LS E65F-BBDA-1-Z, Red, OSRAM Opto Semiconductors Inc.  [E65F]  (value not drawn)
VD56  LED, LS E65F-BBDA-1-Z, Red, OSRAM Opto Semiconductors Inc.  [E65F]  (value not drawn)
VD57  LED, LS E65F-BBDA-1-Z, Red, OSRAM Opto Semiconductors Inc.  [E65F]  (value not drawn)
VD58  LED, LS E65F-BBDA-1-Z, Red, OSRAM Opto Semiconductors Inc.  [E65F]  (value not drawn)
VD59  LED, LS E65F-BBDA-1-Z, Red, OSRAM Opto Semiconductors Inc.  [E65F]  (value not drawn)
VD60  LED, LS E65F-BBDA-1-Z, Red, OSRAM Opto Semiconductors Inc.  [E65F]  (value not drawn)
VD61  LED, LS E65F-BBDA-1-Z, Red, OSRAM Opto Semiconductors Inc.  [E65F]  (value not drawn)
VD62  LED, LS E65F-BBDA-1-Z, Red, OSRAM Opto Semiconductors Inc.  [E65F]  (value not drawn)
VD63  LED, LS E65F-BBDA-1-Z, Red, OSRAM Opto Semiconductors Inc.  [E65F]  (value not drawn)
VD64  LED, LS E65F-BBDA-1-Z, Red, OSRAM Opto Semiconductors Inc.  [E65F]  (value not drawn)
VD65  LED, LS E65F-BBDA-1-Z, Red, OSRAM Opto Semiconductors Inc.  [E65F]  (value not drawn)
VD66  LED, LS E65F-BBDA-1-Z, Red, OSRAM Opto Semiconductors Inc.  [E65F]  (value not drawn)
VD67  LED, LS E65F-BBDA-1-Z, Red, OSRAM Opto Semiconductors Inc.  [E65F]  (value not drawn)
VD68  LED, LS E65F-BBDA-1-Z, Red, OSRAM Opto Semiconductors Inc.  [E65F]  (value not drawn)
VD69  LED, LS E65F-BBDA-1-Z, Red, OSRAM Opto Semiconductors Inc.  [E65F]  (value not drawn)
VD70  LED, LS E65F-BBDA-1-Z, Red, OSRAM Opto Semiconductors Inc.  [E65F]  (value not drawn)
VD71  LED, LS E65F-BBDA-1-Z, Red, OSRAM Opto Semiconductors Inc.  [E65F]  (value not drawn)
VD72  LED, LS E65F-BBDA-1-Z, Red, OSRAM Opto Semiconductors Inc.  [E65F]  (value not drawn)
VD73  LED, LS E65F-BBDA-1-Z, Red, OSRAM Opto Semiconductors Inc.  [E65F]  (value not drawn)
VD74  LED, LS E65F-BBDA-1-Z, Red, OSRAM Opto Semiconductors Inc.  [E65F]  (value not drawn)
VD75  LED, LS E65F-BBDA-1-Z, Red, OSRAM Opto Semiconductors Inc.  [E65F]  (value not drawn)
VD76  LED, LS E65F-BBDA-1-Z, Red, OSRAM Opto Semiconductors Inc.  [E65F]  (value not drawn)
VD77  LED, LS E65F-BBDA-1-Z, Red, OSRAM Opto Semiconductors Inc.  [E65F]  (value not drawn)
VD78  LED, LS E65F-BBDA-1-Z, Red, OSRAM Opto Semiconductors Inc.  [E65F]  (value not drawn)
VD79  LED, LS E65F-BBDA-1-Z, Red, OSRAM Opto Semiconductors Inc.  [E65F]  (value not drawn)
VD80  LED, LS E65F-BBDA-1-Z, Red, OSRAM Opto Semiconductors Inc.  [E65F]  (value not drawn)
VD81  LED, LS E65F-BBDA-1-Z, Red, OSRAM Opto Semiconductors Inc.  [E65F]  (value not drawn)
VD82  LED, LS E65F-BBDA-1-Z, Red, OSRAM Opto Semiconductors Inc.  [E65F]  (value not drawn)
VD83  LED, LS E65F-BBDA-1-Z, Red, OSRAM Opto Semiconductors Inc.  [E65F]  (value not drawn)
VD84  LED, LS E65F-BBDA-1-Z, Red, OSRAM Opto Semiconductors Inc.  [E65F]  (value not drawn)
VD85  LED, LS E65F-BBDA-1-Z, Red, OSRAM Opto Semiconductors Inc.  [E65F]  (value not drawn)
VD86  LED, LS E65F-BBDA-1-Z, Red, OSRAM Opto Semiconductors Inc.  [E65F]  (value not drawn)
VD87  LED, LS E65F-BBDA-1-Z, Red, OSRAM Opto Semiconductors Inc.  [E65F]  (value not drawn)
VD88  LED, LS E65F-BBDA-1-Z, Red, OSRAM Opto Semiconductors Inc.  [E65F]  (value not drawn)
VD89  LED, LS E65F-BBDA-1-Z, Red, OSRAM Opto Semiconductors Inc.  [E65F]  (value not drawn)
VD90  LED, LS E65F-BBDA-1-Z, Red, OSRAM Opto Semiconductors Inc.  [E65F]  (value not drawn)
VD91  LED, LS E65F-BBDA-1-Z, Red, OSRAM Opto Semiconductors Inc.  [E65F]  (value not drawn)
VD92  LED, LS E65F-BBDA-1-Z, Red, OSRAM Opto Semiconductors Inc.  [E65F]  (value not drawn)
VD93  LED, LS E65F-BBDA-1-Z, Red, OSRAM Opto Semiconductors Inc.  [E65F]  (value not drawn)
VD94  LED, LS E65F-BBDA-1-Z, Red, OSRAM Opto Semiconductors Inc.  [E65F]  (value not drawn)
VD95  LED, LS E65F-BBDA-1-Z, Red, OSRAM Opto Semiconductors Inc.  [E65F]  (value not drawn)
VD96  LED, LS E65F-BBDA-1-Z, Red, OSRAM Opto Semiconductors Inc.  [E65F]  (value not drawn)
VD97  LED, LS E65F-BBDA-1-Z, Red, OSRAM Opto Semiconductors Inc.  [E65F]  (value not drawn)
VD98  LED, LS E65F-BBDA-1-Z, Red, OSRAM Opto Semiconductors Inc.  [E65F]  (value not drawn)
VD99  LED, LS E65F-BBDA-1-Z, Red, OSRAM Opto Semiconductors Inc.  [E65F]  (value not drawn)
VS1  BZX84  [SOT23]  (value not drawn)
VS2  BZX84  [SOT23]  (value not drawn)
VS3  BZX84  [SOT23]  (value not drawn)
VS4  BZX84  [SOT23]  (value not drawn)
VS5  BZX84  [SOT23]  (value not drawn)
VS6  BZX84  [SOT23]  (value not drawn)
VS7  BZX84  [SOT23]  (value not drawn)
VS8  BZX84  [SOT23]  (value not drawn)
VS9  BZX84  [SOT23]  (value not drawn)
VS10  BZX84  [SOT23]  (value not drawn)
VS11  BZX84  [SOT23]  (value not drawn)
VS12  BZX84  [SOT23]  (value not drawn)
VS13  BZX84  [SOT23]  (value not drawn)
VS14  BZX84  [SOT23]  (value not drawn)
VS15  BZX84  [SOT23]  (value not drawn)
VS16  BZX84  [SOT23]  (value not drawn)
VS17  BZX84  [SOT23]  (value not drawn)
VS18  BZX84  [SOT23]  (value not drawn)
VS19  BZX84  [SOT23]  (value not drawn)
VS20  BZX84  [SOT23]  (value not drawn)
VS21  BZX84  [SOT23]  (value not drawn)
VS22  BZX84  [SOT23]  (value not drawn)
VS23  BZX84  [SOT23]  (value not drawn)
VS24  BZX84  [SOT23]  (value not drawn)
VS25  BZX84  [SOT23]  (value not drawn)
VS26  BZX84  [SOT23]  (value not drawn)
VS27  BZX84  [SOT23]  (value not drawn)
VS28  BZX84  [SOT23]  (value not drawn)
VS29  BZX84  [SOT23]  (value not drawn)
VS30  BZX84  [SOT23]  (value not drawn)
VS31  BZX84  [SOT23]  (value not drawn)
VS32  BZX84  [SOT23]  (value not drawn)
VS33  BZX84  [SOT23]  (value not drawn)
VS34  BZX84  [SOT23]  (value not drawn)
VS35  BZX84  [SOT23]  (value not drawn)
VS36  BZX84  [SOT23]  (value not drawn)
VS37  BZX84  [SOT23]  (value not drawn)
VS38  BZX84  [SOT23]  (value not drawn)
VS39  BZX84  [SOT23]  (value not drawn)
VS40  BZX84  [SOT23]  (value not drawn)
VS41  BZX84  [SOT23]  (value not drawn)
VS42  BZX84  [SOT23]  (value not drawn)
VS43  BZX84  [SOT23]  (value not drawn)
VS44  BZX84  [SOT23]  (value not drawn)
VS45  BZX84  [SOT23]  (value not drawn)
VS46  BZX84  [SOT23]  (value not drawn)
VS47  BZX84  [SOT23]  (value not drawn)
VS48  BZX84  [SOT23]  (value not drawn)
VS49  BZX84  [SOT23]  (value not drawn)
VS50  BZX84  [SOT23]  (value not drawn)
VS51  BZX84  [SOT23]  (value not drawn)
VS52  BZX84  [SOT23]  (value not drawn)
VS53  BZX84  [SOT23]  (value not drawn)
VS54  BZX84  [SOT23]  (value not drawn)
VS55  BZX84  [SOT23]  (value not drawn)
VS56  BZX84  [SOT23]  (value not drawn)
VS57  BZX84  [SOT23]  (value not drawn)
VS58  BZX84  [SOT23]  (value not drawn)
VS59  BZX84  [SOT23]  (value not drawn)
VS60  BZX84  [SOT23]  (value not drawn)
VS61  BZX84  [SOT23]  (value not drawn)
VS62  BZX84  [SOT23]  (value not drawn)
VS63  BZX84  [SOT23]  (value not drawn)
VS64  BZX84  [SOT23]  (value not drawn)
VS65  BZX84  [SOT23]  (value not drawn)
VS66  BZX84  [SOT23]  (value not drawn)
VS67  BZX84  [SOT23]  (value not drawn)
VS68  BZX84  [SOT23]  (value not drawn)
VS69  BZX84  [SOT23]  (value not drawn)
VS70  BZX84  [SOT23]  (value not drawn)
VS71  BZX84  [SOT23]  (value not drawn)
VS72  BZX84  [SOT23]  (value not drawn)
VS73  BZX84  [SOT23]  (value not drawn)
VS74  BZX84  [SOT23]  (value not drawn)
VS75  BZX84  [SOT23]  (value not drawn)
VS76  BZX84  [SOT23]  (value not drawn)
VS77  BZX84  [SOT23]  (value not drawn)
VS78  BZX84  [SOT23]  (value not drawn)
VS79  BZX84  [SOT23]  (value not drawn)
VS80  BZX84  [SOT23]  (value not drawn)
VS81  BZX84  [SOT23]  (value not drawn)
VS82  BZX84  [SOT23]  (value not drawn)
VS83  BZX84  [SOT23]  (value not drawn)
VS84  BZX84  [SOT23]  (value not drawn)
VS85  BZX84  [SOT23]  (value not drawn)
VS86  BZX84  [SOT23]  (value not drawn)
VS87  BZX84  [SOT23]  (value not drawn)
VS88  BZX84  [SOT23]  (value not drawn)
VS89  BZX84  [SOT23]  (value not drawn)
VS90  BZX84  [SOT23]  (value not drawn)
VS91  BZX84  [SOT23]  (value not drawn)
VS92  BZX84  [SOT23]  (value not drawn)
VS93  BZX84  [SOT23]  (value not drawn)
VS94  BZX84  [SOT23]  (value not drawn)
VS95  BZX84  [SOT23]  (value not drawn)
VS96  BZX84  [SOT23]  (value not drawn)
VS97  BZX84  [SOT23]  (value not drawn)
VS98  BZX84  [SOT23]  (value not drawn)
VS99  BZX84  [SOT23]  (value not drawn)

### Nets
A: ST1.10
B: R17.2 R18.2 R19.2 R20.2 R21.2 R22.2 R24.2 ST1.6
C: R1.2 R2.2 R3.2 R4.2 R5.2 R6.2 R8.2 ST1.4
D: R9.2 R10.2 R11.2 R12.2 R13.2 R14.2 R16.2 ST1.5
F: ST1.9
G: ST1.8
ULED: ST1.1 ST1.2 VD1.2(A) VD6.2(A) VD11.2(A) VD16.2(A) VD21.2(A) VD26.2(A) VD31.2(A) VD34.2(A) VD39.2(A) VD44.2(A) VD49.2(A) VD54.2(A) VD59.2(A) VD64.2(A) VD67.2(A) VD72.2(A) VD77.2(A) VD82.2(A) VD87.2(A) VD92.2(A) VD97.2(A) VS1.3 VS6.3 VS11.3 VS16.3 VS21.3 VS26.3 VS31.3 VS34.3 VS39.3 VS44.3 VS49.3 VS54.3 VS59.3 VS64.3 VS67.3 VS72.3 VS77.3 VS82.3 VS87.3 VS92.3 VS97.3
NetR1_1: R1.1 VD5.1(K) VS5.1
NetR2_1: R2.1 VD10.1(K) VS10.1
NetR3_1: R3.1 VD15.1(K) VS15.1
NetR4_1: R4.1 VD20.1(K) VS20.1
NetR5_1: R5.1 VD25.1(K) VS25.1
NetR6_1: R6.1 VD30.1(K) VS30.1
NetR7_1: R7.1 VD33.1(K) VS33.1
NetR7_2: R7.2 R8.1
NetR9_1: R9.1 VD38.1(K) VS38.1
NetR10_1: R10.1 VD43.1(K) VS43.1
NetR11_1: R11.1 VD48.1(K) VS48.1
NetR12_1: R12.1 VD53.1(K) VS53.1
NetR13_1: R13.1 VD58.1(K) VS58.1
NetR14_1: R14.1 VD63.1(K) VS63.1
NetR15_1: R15.1 VD66.1(K) VS66.1
NetR15_2: R15.2 R16.1
NetR17_1: R17.1 VD71.1(K) VS71.1
NetR18_1: R18.1 VD76.1(K) VS76.1
NetR19_1: R19.1 VD81.1(K) VS81.1
NetR20_1: R20.1 VD86.1(K) VS86.1
NetR21_1: R21.1 VD91.1(K) VS91.1
NetR22_1: R22.1 VD96.1(K) VS96.1
NetR23_1: R23.1 VD99.1(K) VS99.1
NetR23_2: R23.2 R24.1
NetVD1_1: VD1.1(K) VD2.2(A) VS1.1 VS2.3
NetVD2_1: VD2.1(K) VD3.2(A) VS2.1 VS3.3
NetVD3_1: VD3.1(K) VD4.2(A) VS3.1 VS4.3
NetVD4_1: VD4.1(K) VD5.2(A) VS4.1 VS5.3
NetVD6_1: VD6.1(K) VD7.2(A) VS6.1 VS7.3
NetVD7_1: VD7.1(K) VD8.2(A) VS7.1 VS8.3
NetVD8_1: VD8.1(K) VD9.2(A) VS8.1 VS9.3
NetVD9_1: VD9.1(K) VD10.2(A) VS9.1 VS10.3
NetVD11_1: VD11.1(K) VD12.2(A) VS11.1 VS12.3
NetVD12_1: VD12.1(K) VD13.2(A) VS12.1 VS13.3
NetVD13_1: VD13.1(K) VD14.2(A) VS13.1 VS14.3
NetVD14_1: VD14.1(K) VD15.2(A) VS14.1 VS15.3
NetVD16_1: VD16.1(K) VD17.2(A) VS16.1 VS17.3
NetVD17_1: VD17.1(K) VD18.2(A) VS17.1 VS18.3
NetVD18_1: VD18.1(K) VD19.2(A) VS18.1 VS19.3
NetVD19_1: VD19.1(K) VD20.2(A) VS19.1 VS20.3
NetVD21_1: VD21.1(K) VD22.2(A) VS21.1 VS22.3
NetVD22_1: VD22.1(K) VD23.2(A) VS22.1 VS23.3
NetVD23_1: VD23.1(K) VD24.2(A) VS23.1 VS24.3
NetVD24_1: VD24.1(K) VD25.2(A) VS24.1 VS25.3
NetVD26_1: VD26.1(K) VD27.2(A) VS26.1 VS27.3
NetVD27_1: VD27.1(K) VD28.2(A) VS27.1 VS28.3
NetVD28_1: VD28.1(K) VD29.2(A) VS28.1 VS29.3
NetVD29_1: VD29.1(K) VD30.2(A) VS29.1 VS30.3
NetVD31_1: VD31.1(K) VD32.2(A) VS31.1 VS32.3
NetVD32_1: VD32.1(K) VD33.2(A) VS32.1 VS33.3
NetVD34_1: VD34.1(K) VD35.2(A) VS34.1 VS35.3
NetVD35_1: VD35.1(K) VD36.2(A) VS35.1 VS36.3
NetVD36_1: VD36.1(K) VD37.2(A) VS36.1 VS37.3
NetVD37_1: VD37.1(K) VD38.2(A) VS37.1 VS38.3
NetVD39_1: VD39.1(K) VD40.2(A) VS39.1 VS40.3
NetVD40_1: VD40.1(K) VD41.2(A) VS40.1 VS41.3
NetVD41_1: VD41.1(K) VD42.2(A) VS41.1 VS42.3
NetVD42_1: VD42.1(K) VD43.2(A) VS42.1 VS43.3
NetVD44_1: VD44.1(K) VD45.2(A) VS44.1 VS45.3
NetVD45_1: VD45.1(K) VD46.2(A) VS45.1 VS46.3
NetVD46_1: VD46.1(K) VD47.2(A) VS46.1 VS47.3
NetVD47_1: VD47.1(K) VD48.2(A) VS47.1 VS48.3
NetVD49_1: VD49.1(K) VD50.2(A) VS49.1 VS50.3
NetVD50_1: VD50.1(K) VD51.2(A) VS50.1 VS51.3
NetVD51_1: VD51.1(K) VD52.2(A) VS51.1 VS52.3
NetVD52_1: VD52.1(K) VD53.2(A) VS52.1 VS53.3
NetVD54_1: VD54.1(K) VD55.2(A) VS54.1 VS55.3
NetVD55_1: VD55.1(K) VD56.2(A) VS55.1 VS56.3
NetVD56_1: VD56.1(K) VD57.2(A) VS56.1 VS57.3
NetVD57_1: VD57.1(K) VD58.2(A) VS57.1 VS58.3
NetVD59_1: VD59.1(K) VD60.2(A) VS59.1 VS60.3
NetVD60_1: VD60.1(K) VD61.2(A) VS60.1 VS61.3
NetVD61_1: VD61.1(K) VD62.2(A) VS61.1 VS62.3
NetVD62_1: VD62.1(K) VD63.2(A) VS62.1 VS63.3
NetVD64_1: VD64.1(K) VD65.2(A) VS64.1 VS65.3
NetVD65_1: VD65.1(K) VD66.2(A) VS65.1 VS66.3
NetVD67_1: VD67.1(K) VD68.2(A) VS67.1 VS68.3
NetVD68_1: VD68.1(K) VD69.2(A) VS68.1 VS69.3
NetVD69_1: VD69.1(K) VD70.2(A) VS69.1 VS70.3
NetVD70_1: VD70.1(K) VD71.2(A) VS70.1 VS71.3
NetVD72_1: VD72.1(K) VD73.2(A) VS72.1 VS73.3
NetVD73_1: VD73.1(K) VD74.2(A) VS73.1 VS74.3
NetVD74_1: VD74.1(K) VD75.2(A) VS74.1 VS75.3
NetVD75_1: VD75.1(K) VD76.2(A) VS75.1 VS76.3
NetVD77_1: VD77.1(K) VD78.2(A) VS77.1 VS78.3
NetVD78_1: VD78.1(K) VD79.2(A) VS78.1 VS79.3
NetVD79_1: VD79.1(K) VD80.2(A) VS79.1 VS80.3
NetVD80_1: VD80.1(K) VD81.2(A) VS80.1 VS81.3
NetVD82_1: VD82.1(K) VD83.2(A) VS82.1 VS83.3
NetVD83_1: VD83.1(K) VD84.2(A) VS83.1 VS84.3
NetVD84_1: VD84.1(K) VD85.2(A) VS84.1 VS85.3
NetVD85_1: VD85.1(K) VD86.2(A) VS85.1 VS86.3
NetVD87_1: VD87.1(K) VD88.2(A) VS87.1 VS88.3
NetVD88_1: VD88.1(K) VD89.2(A) VS88.1 VS89.3
NetVD89_1: VD89.1(K) VD90.2(A) VS89.1 VS90.3
NetVD90_1: VD90.1(K) VD91.2(A) VS90.1 VS91.3
NetVD92_1: VD92.1(K) VD93.2(A) VS92.1 VS93.3
NetVD93_1: VD93.1(K) VD94.2(A) VS93.1 VS94.3
NetVD94_1: VD94.1(K) VD95.2(A) VS94.1 VS95.3
NetVD95_1: VD95.1(K) VD96.2(A) VS95.1 VS96.3
NetVD97_1: VD97.1(K) VD98.2(A) VS97.1 VS98.3
NetVD98_1: VD98.1(K) VD99.2(A) VS98.1 VS99.3

Not connected (* = marked no-connect by the designer): ST1 3 7 11 12 13 14 15 16 17 18 19 20; VS1 2; VS2 2; VS3 2; VS4 2; VS5 2; VS6 2; VS7 2; VS8 2; VS9 2; VS10 2; VS11 2; VS12 2; VS13 2; VS14 2; VS15 2; VS16 2; VS17 2; VS18 2; VS19 2; VS20 2; VS21 2; VS22 2; VS23 2; VS24 2; VS25 2; VS26 2; VS27 2; VS28 2; VS29 2; VS30 2; VS31 2; VS32 2; VS33 2; VS34 2; VS35 2; VS36 2; VS37 2; VS38 2; VS39 2; VS40 2; VS41 2; VS42 2; VS43 2; VS44 2; VS45 2; VS46 2; VS47 2; VS48 2; VS49 2; VS50 2; VS51 2; VS52 2; VS53 2; VS54 2; VS55 2; VS56 2; VS57 2; VS58 2; VS59 2; VS60 2; VS61 2; VS62 2; VS63 2; VS64 2; VS65 2; VS66 2; VS67 2; VS68 2; VS69 2; VS70 2; VS71 2; VS72 2; VS73 2; VS74 2; VS75 2; VS76 2; VS77 2; VS78 2; VS79 2; VS80 2; VS81 2; VS82 2; VS83 2; VS84 2; VS85 2; VS86 2; VS87 2; VS88 2; VS89 2; VS90 2; VS91 2; VS92 2; VS93 2; VS94 2; VS95 2; VS96 2; VS97 2; VS98 2; VS99 2

### Library data of the parts
VD1-VD99 = 4176: as VD100 on sheet LED fix910 RD 2000278 (4F00224A_7P00494A)_2; Value: LS E65F-BBDA-1-Z; Component_Type: LED; Package: PLCC-4; Marking_Code: -; Manufacturer: OSRAM Opto Semiconductors Inc.; Manufacturer_PN: LS E65F-BBDA-1-Z; ComponentLink1Description: Datasheet; ComponentLink1URL: https://media.digikey.com/pdf/Data%20Sheets/Osram%20PDFs/LS_E65F_Rev1.2.pdf; Price_EUR: 0,15835; Status: Unchecked; Date_of_Update: 12.11.2018 13:55:11; Date_of_Creation: 30.10.2018 19:15:38
VS1-VS99 = BZX84: OriginalName: DIODE; Value: *
ST1 = BAND10_M: ModifyDate: 07/10/2006 11:23:08

## Nets that join several sheets
A: LED fix910 RD 2000278 (4F00224A_7P00494A)_2 (7 pins), LED fix910 RD 2000278 (4F00224A_7P00494A)_1 (ST1.10)
F: LED fix910 RD 2000278 (4F00224A_7P00494A)_2 (7 pins), LED fix910 RD 2000278 (4F00224A_7P00494A)_1 (ST1.9)
G: LED fix910 RD 2000278 (4F00224A_7P00494A)_2 (7 pins), LED fix910 RD 2000278 (4F00224A_7P00494A)_1 (ST1.8)
ULED: LED fix910 RD 2000278 (4F00224A_7P00494A)_2 (42 pins), LED fix910 RD 2000278 (4F00224A_7P00494A)_1 (44 pins)